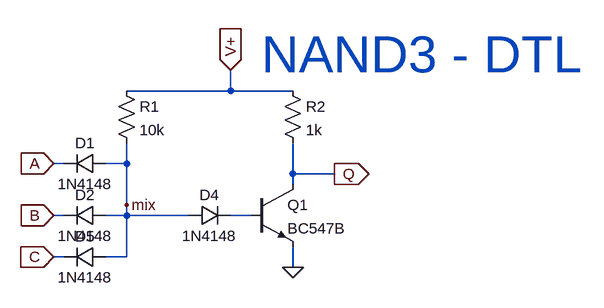
[diagram p0: schematic NAND3.asc]
NAND3.asc, the LTspice schematic file:
Version 4
SHEET 1 880 680
WIRE 288 -48 288 -80
WIRE 288 -48 128 -48
WIRE 384 -48 288 -48
WIRE 32 64 16 64
WIRE 128 64 128 32
WIRE 128 64 96 64
WIRE 384 80 384 32
WIRE 448 80 384 80
WIRE 384 96 384 80
WIRE 128 128 128 64
WIRE 32 144 16 144
WIRE 128 144 128 128
WIRE 128 144 96 144
WIRE 224 144 128 144
WIRE 320 144 288 144
WIRE 32 208 16 208
WIRE 128 208 128 144
WIRE 128 208 96 208
WIRE 384 224 384 192
FLAG 384 224 0
FLAG 448 80 Q
IOPIN 448 80 Out
FLAG 16 64 A
IOPIN 16 64 In
FLAG 16 144 B
IOPIN 16 144 In
FLAG 288 -80 V+
IOPIN 288 -80 In
FLAG 128 128 mix
FLAG 16 208 C
IOPIN 16 208 In
SYMBOL diode 96 48 R90
WINDOW 0 0 32 VBottom 2
WINDOW 3 32 32 VTop 2
SYMATTR InstName D1
SYMATTR Value 1N4148
SYMBOL res 112 -64 R0
SYMATTR InstName R1
SYMATTR Value 10k
SYMBOL npn 320 96 R0
SYMATTR InstName Q1
SYMATTR Value BC547B
SYMBOL res 368 -64 R0
SYMATTR InstName R2
SYMATTR Value 1k
SYMBOL diode 96 128 R90
WINDOW 0 0 32 VBottom 2
WINDOW 3 32 32 VTop 2
SYMATTR InstName D2
SYMATTR Value 1N4148
SYMBOL diode 224 160 R270
WINDOW 0 32 32 VTop 2
WINDOW 3 0 32 VBottom 2
SYMATTR InstName D4
SYMATTR Value 1N4148
SYMBOL diode 96 192 R90
WINDOW 0 0 32 VBottom 2
WINDOW 3 32 32 VTop 2
SYMATTR InstName D5
SYMATTR Value 1N4148
TEXT 336 -104 Left 6 ;NAND3 - DTL

The netlist it stands for:
* NAND3.asc
D1 mix A 1N4148
R1 V+ mix 10k
Q1 Q N001 0 0 BC547B
R2 V+ Q 1k
D2 mix B 1N4148
D4 mix N001 1N4148
D5 mix C 1N4148
.model D D
.lib standard.dio
.model NPN NPN
.model PNP PNP
.lib standard.bjt
* NAND3 - DTL
.backanno
.end